# Altium project Main.PrjPcb
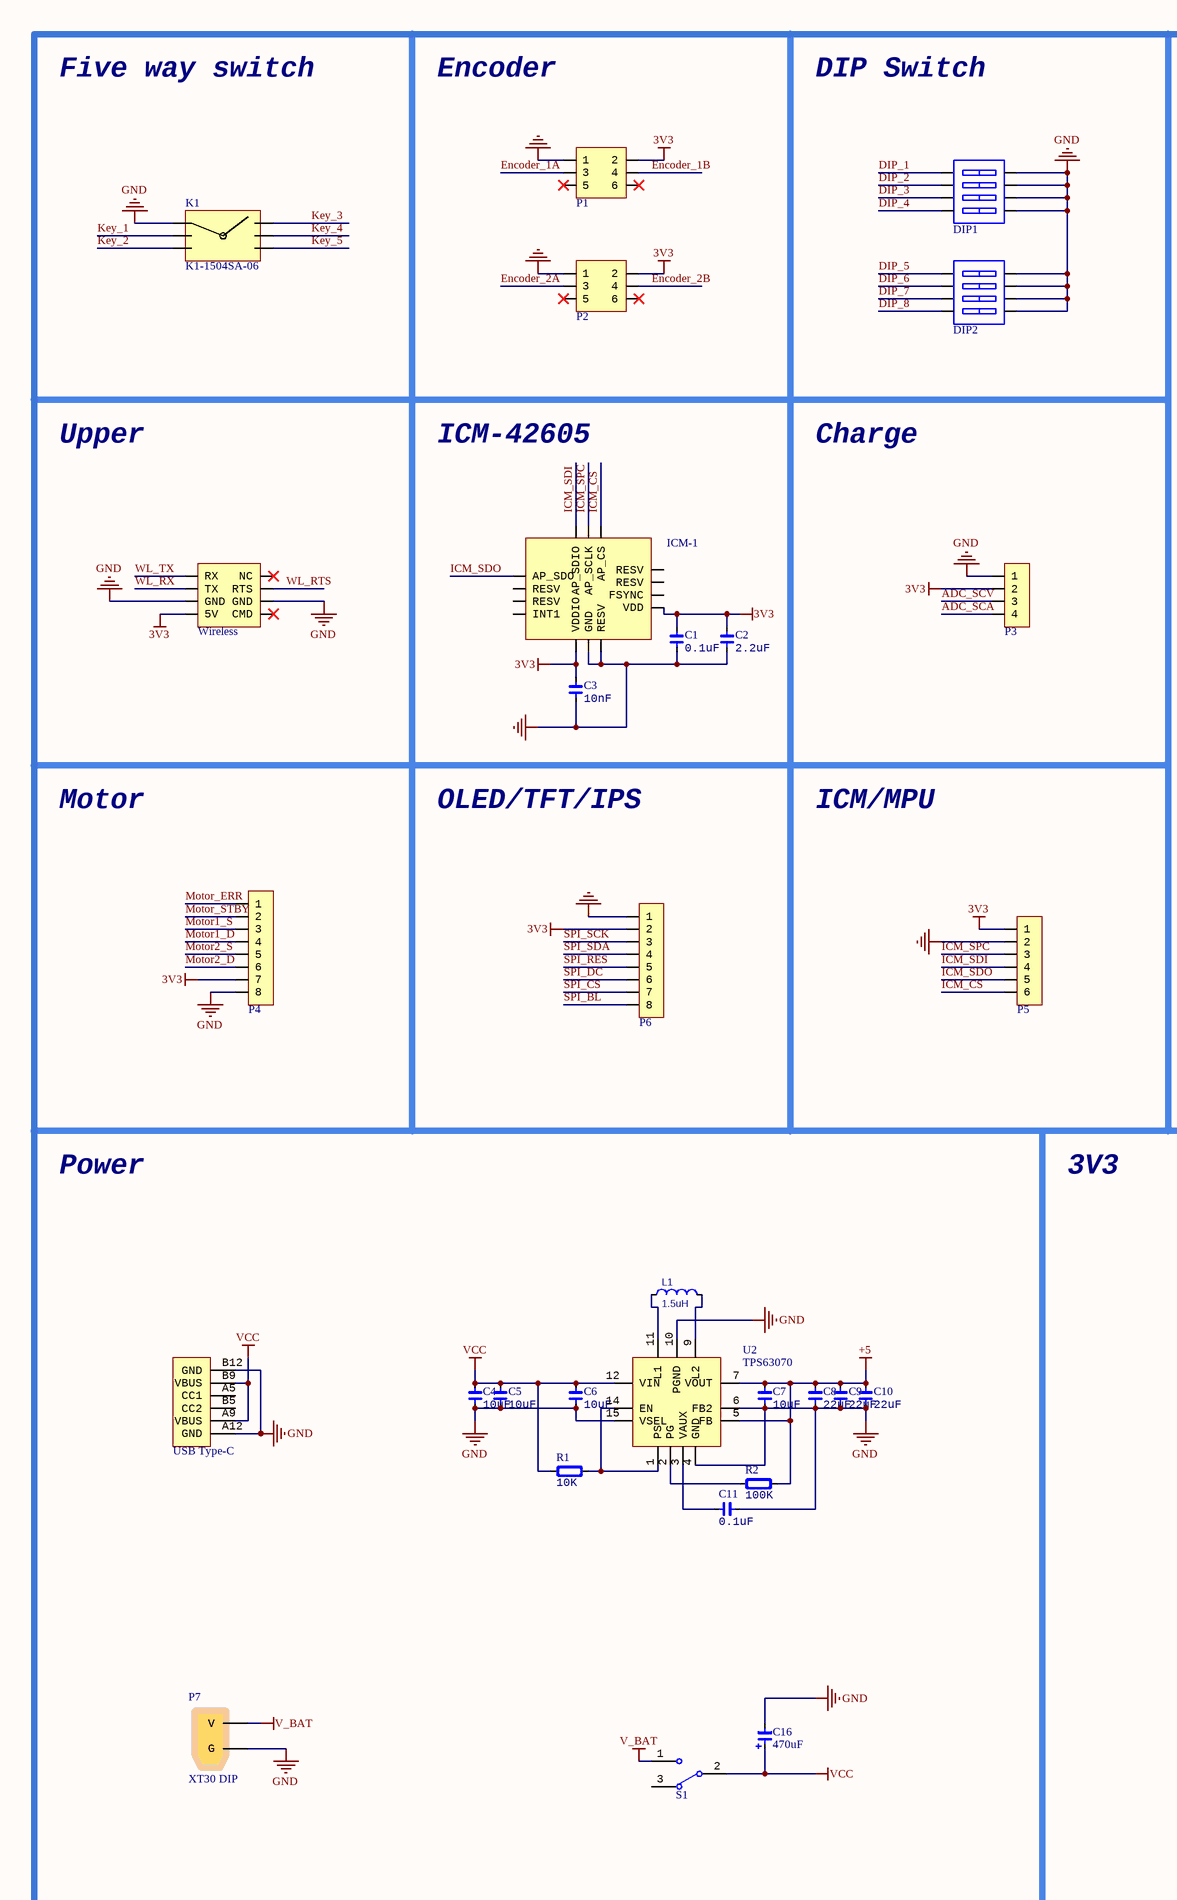
[diagram p0: Main.SchDoc, left]
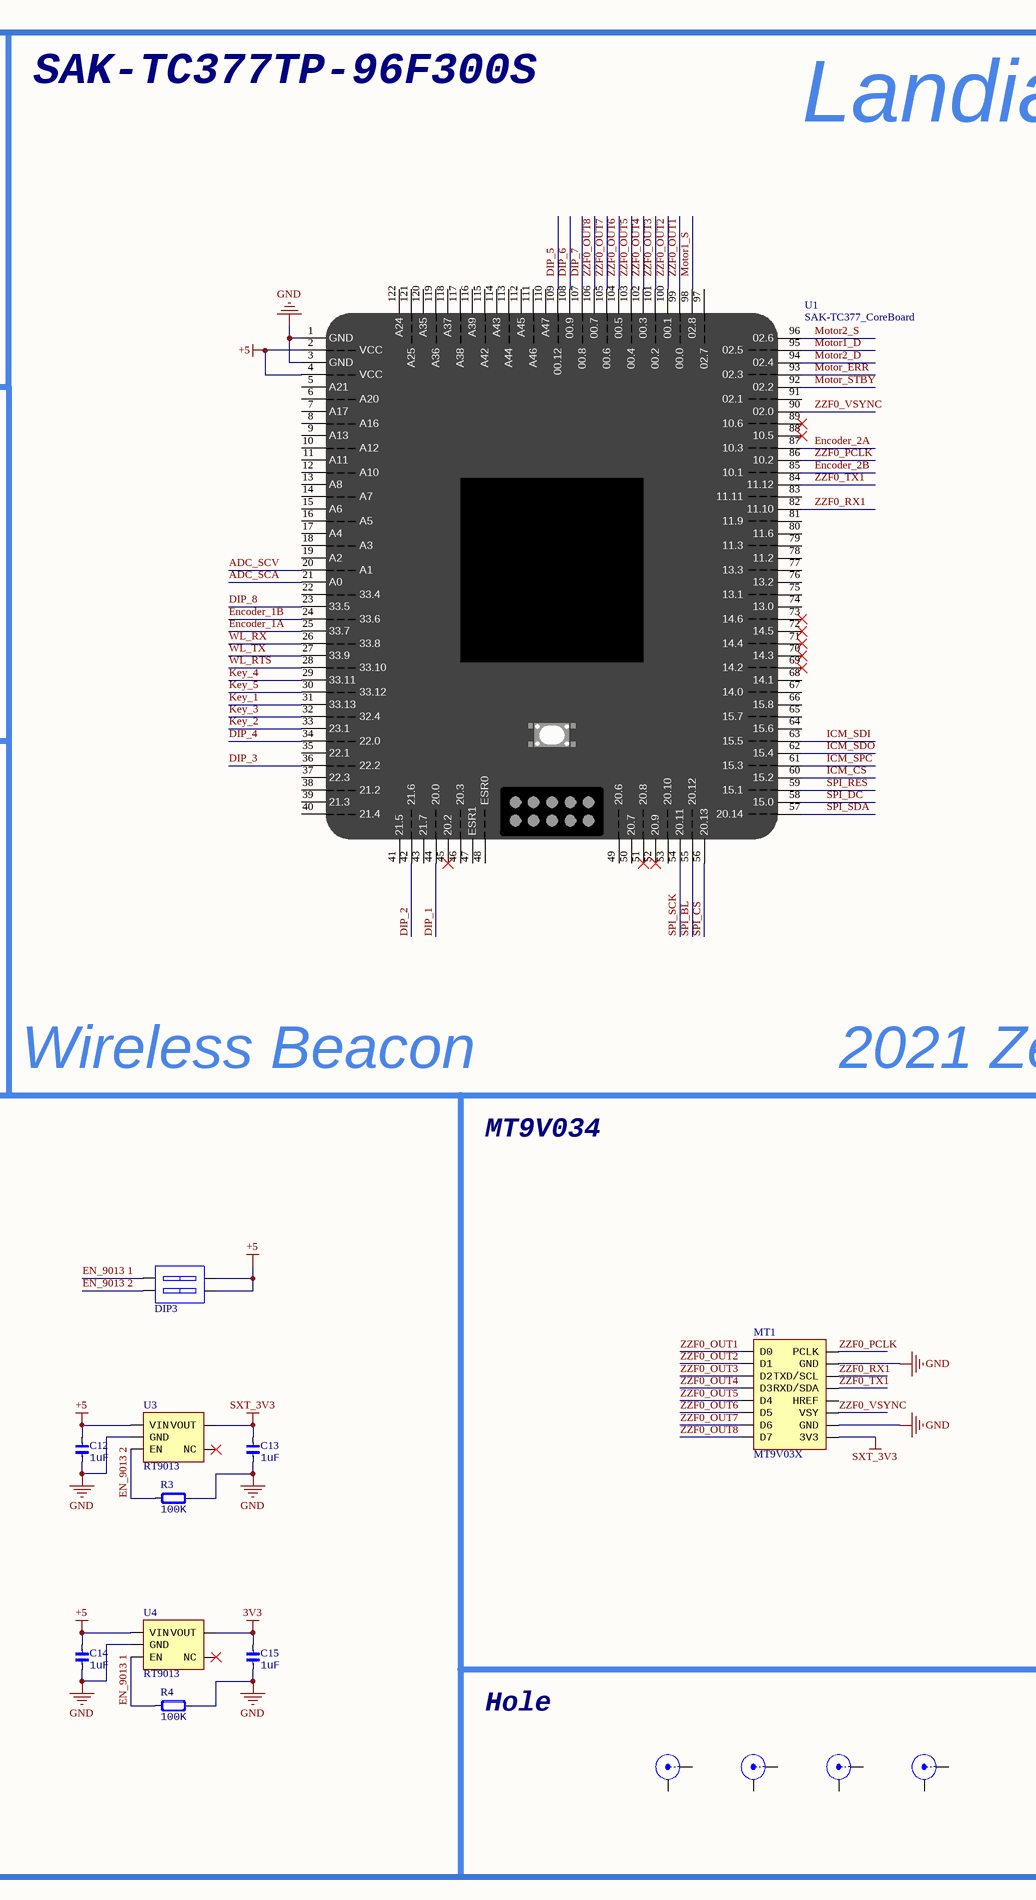
[diagram p1: Main.SchDoc, right]
1 sheet, 45 parts. Net scope: global (net labels, ports and power ports of the same name join across sheets).
Board file: Main.PcbDoc

## Sheet Main.SchDoc
size 477 x 398 mm; SheetNumber: 1; SheetTotal: 1

### Parts
C1  0.1uF  [0805_CAP]
C2  2.2uF  [0805_CAP]
C3  10nF  [0805_CAP]
C4  10uF  [0805_CAP]
C5  10uF  [0805_CAP]
C6  10uF  [0603_CAP]
C7  10uF  [0603_CAP]
C8  22uF  [0805_CAP]
C9  22uF  [0805_CAP]
C10  22uF  [0805_CAP]
C11  0.1uF  [0805_CAP]
C12  1uF  [0805_CAP]
C13  1uF  [0805_CAP]
C14  1uF  [0805_CAP]
C15  1uF  [0805_CAP]
C16  470uF  [CAP_8X10]
DIP1  CSW-4P_SMD  [DIP Switch 4P - SMD]  (value not drawn)
DIP2  CSW-4P_SMD  [DIP Switch 4P - SMD]  (value not drawn)
DIP3  CSW-2P  [DIP Switch 2P]  (value not drawn)
Hole1  Hole  [Hole]  (value not drawn)
Hole2  Hole  [Hole]  (value not drawn)
Hole3  Hole  [Hole]  (value not drawn)
Hole4  Hole  [Hole]  (value not drawn)
ICM-1  ICM-42605  [LGA-14_L3.0-W2.5-P0.50-TL]  (value not drawn)
K1  K1-1504SA-06  [SW-SMD_K1-1504SA-06]
L1  1.5uH  [CDRH74R]
MT1  MT9V03X  [MT9V034]
P1  HDR2x3_2.54  [HDR_2X3]  (value not drawn)
P2  HDR2x3_2.54  [HDR_2X3]  (value not drawn)
P3  HDR1x4_2.54  [HDR_1X4]  (value not drawn)
P4  HDR1x8_2.54_F  [HDR_1X8_F]  (value not drawn)
P5  HDR1x6_2.54  [HDR_1X6]  (value not drawn)
P6  HDR1x8_2.54_F  [HDR_1X8_F]  (value not drawn)
P7  XT30 DIP  [XT30 DIP]
R1  10K  [0805_RES]
R2  100K  [0805_RES]
R3  100K  [0805_RES]
R4  100K  [0805_RES]
S1  SMTS-102  [SMTS-102]  (value not drawn)
Type-C1  USB Type-C  [Type-C 6P]
U1  SAK-TC377_CoreBoard  [TC377_CoreBoard]
U2  TPS63070  [VQFN-15_L3.0-W2.5-P0.50-BL]
U3  RT9013  [SOT-23-5_L3.0-W1.7-P0.95-LS2.8-BR]
U4  RT9013  [SOT-23-5_L3.0-W1.7-P0.95-LS2.8-BR]
Wireless1  Wireless  [HDR_2X4_F]

### Nets
3V3: C1.1 C2.1 C3.1 C15.2 ICM-1.5(VDDIO) ICM-1.8(VDD) P1.2 P2.2 P3.2 P4.7 P5.1 P6.2 U4.5(VOUT) Wireless1.7(5V)
+5: C7.2 C8.2 C9.2 C10.2 C12.2 C14.2 DIP3.4 DIP3.5 R2.2 U1.2(VCC) U1.4(VCC) U2.5(FB) U2.7(VOUT) U3.1(VIN) U4.1(VIN)
GND: C1.2 C2.2 C3.2 C4.1 C5.1 C6.1 C7.1 C8.1 C9.1 C10.1 C11.1 C12.1 C13.1 C14.1 C15.1 C16.2 DIP1.5 DIP1.6 DIP1.7 DIP1.8 DIP2.5 DIP2.6 DIP2.7 DIP2.8 ICM-1.6(GND) ICM-1.7(RESV) K1.1 MT1.4(GND) MT1.14(GND) P1.1 P2.1 P3.1 P4.8 P5.2 P6.1 P7.2(G) R3.2 R4.2 Type-C1.A12(GND) Type-C1.B12(GND) U1.1(GND) U1.3(GND) U2.4(GND) U2.6(FB2) U2.10(PGND) U2.15(VSEL) U3.2(GND) U4.2(GND) Wireless1.5(GND) Wireless1.6(GND)
SXT_3V3: C13.2 MT1.16(3V3) U3.5(VOUT)
V_BAT: P7.1(V) S1.1
VCC: C4.2 C5.2 C6.2 C16.1 R1.1 S1.2 Type-C1.A9(VBUS) Type-C1.B9(VBUS) U2.12(VIN)
ADC_SCA: P3.4 U1.21(A0)
ADC_SCV: P3.3 U1.20(A1)
DIP_1: DIP1.1 U1.44(20.0)
DIP_2: DIP1.2 U1.42(21.6)
DIP_3: DIP1.3 U1.36(22.2)
DIP_4: DIP1.4 U1.34(22.0)
DIP_5: DIP2.1 U1.109(00.12)
DIP_6: DIP2.2 U1.108(00.9)
DIP_7: DIP2.3 U1.107(00.8)
DIP_8: DIP2.4 U1.23(33.5)
EN_9013 1: DIP3.1 R4.1 U4.3(EN)
EN_9013 2: DIP3.2 R3.1 U3.3(EN)
Encoder_1A: P1.3 U1.25(33.7)
Encoder_1B: P1.4 U1.24(33.6)
Encoder_2A: P2.3 U1.87(10.3)
Encoder_2B: P2.4 U1.85(10.1)
ICM_CS: ICM-1.12(AP_CS) P5.6 U1.60(15.2)
ICM_SDI: ICM-1.14(AP_SDIO) P5.4 U1.63(15.5)
ICM_SDO: ICM-1.1(AP_SDO) P5.5 U1.62(15.4)
ICM_SPC: ICM-1.13(AP_SCLK) P5.3 U1.61(15.3)
Key_1: K1.2 U1.31(33.13)
Key_2: K1.3 U1.33(23.1)
Key_3: K1.4 U1.32(32.4)
Key_4: K1.5 U1.29(33.11)
Key_5: K1.6 U1.30(33.12)
Motor1_D: P4.4 U1.95(02.5)
Motor1_S: P4.3 U1.98(02.8)
Motor2_D: P4.6 U1.94(02.4)
Motor2_S: P4.5 U1.96(02.6)
Motor_ERR: P4.1 U1.93(02.3)
Motor_STBY: P4.2 U1.92(02.2)
SPI_BL: P6.8 U1.55(20.12)
SPI_CS: P6.7 U1.56(20.13)
SPI_DC: P6.6 U1.58(15.0)
SPI_RES: P6.5 U1.59(15.1)
SPI_SCK: P6.3 U1.54(20.11)
SPI_SDA: P6.4 U1.57(20.14)
WL_RTS: U1.28(33.10) Wireless1.4(RTS)
WL_RX: U1.26(33.8) Wireless1.3(TX)
WL_TX: U1.27(33.9) Wireless1.1(RX)
ZZF0_OUT1: MT1.1(D0) U1.99(00.0)
ZZF0_OUT2: MT1.3(D1) U1.100(00.1)
ZZF0_OUT3: MT1.5(D2) U1.101(00.2)
ZZF0_OUT4: MT1.7(D3) U1.102(00.3)
ZZF0_OUT5: MT1.9(D4) U1.103(00.4)
ZZF0_OUT6: MT1.11(D5) U1.104(00.5)
ZZF0_OUT7: MT1.13(D6) U1.105(00.6)
ZZF0_OUT8: MT1.15(D7) U1.106(00.7)
ZZF0_PCLK: MT1.2(PCLK) U1.86(10.2)
ZZF0_RX1: MT1.6(TXD/SCL) U1.82(11.10)
ZZF0_TX1: MT1.8(RXD/SDA) U1.84(11.12)
ZZF0_VSYNC: MT1.12(VSY) U1.90(02.0)
NetC11_2: C11.2 U2.3(VAUX)
NetL1_1: L1.1 U2.11(L1)
NetL1_2: L1.2 U2.9(L2)
NetR1_2: R1.2 U2.1(PS) U2.14(EN)
NetR2_1: R2.1 U2.2(PG)

Not connected (* = marked no-connect by the designer): Hole1 1(X) 2(Y); Hole2 1(X) 2(Y); Hole3 1(X) 2(Y); Hole4 1(X) 2(Y); ICM-1 2(RESV) 3(RESV) 4(INT1) 9(FSYNC) 10(RESV) 11(RESV); MT1 10(HREF); P1 5* 6*; P2 5* 6*; S1 3; Type-C1 A5(CC1) B5(CC2); U1 5(A21) 6(A20) 7(A17) 8(A16) 9(A13) 10(A12) 11(A11) 12(A10) 13(A8) 14(A7) 15(A6) 16(A5) 17(A4) 18(A3) 19(A2) 22(33.4) 35(22.1) 37(22.3) 38(21.2) 39(21.3) 40(21.4) 41(21.5) 43(21.7) 45(20.2)* 46(20.3) 47(ESR1) 48(ESR0) 49(20.6) 50(20.7) 51(20.8)* 52(20.9)* 53(20.10) 64(15.6) 65(15.7) 66(15.8) 67(14.0) 68(14.1) 69(14.2)* 70(14.3)* 71(14.4)* 72(14.5)* 73(14.6)* 74(13.0) 75(13.1) 76(13.2) 77(13.3) 78(11.2) 79(11.3) 80(11.6) 81(11.9) 83(11.11) 88(10.5)* 89(10.6)* 91(02.1) 97(02.7) 110(A47) 111(A46) 112(A45) 113(A44) 114(A43) 115(A42) 116(A39) 117(A38) 118(A37) 119(A36) 120(A35) 121(A25) 122(A24); U3 4(NC)*; U4 4(NC)*; Wireless1 2(NC)* 8(CMD)*

### Notes on the sheet
- Five way switch
- Encoder
- DIP Switch
- SAK-TC377TP-96F300S
- Landian
- Upper
- ICM-42605
- Charge
- Motor
- OLED/TFT/IPS
- ICM/MPU
- Wireless Beacon
- 2021 Zero
- Power
- 3V3
- MT9V034
- Hole

### Library data of the parts
C1-C5 C8-C15 = 0805_CAP: Capacitor; Specification: X7R 50V; Manufacturer: *
C6 C7 = 0603_CAP: Capacitor; Specification: X7R 50V; Manufacturer: *
C16 = CAP_10: Electrolytic capacitor
DIP1 DIP2 = CSW-4P_SMD: BOM名称: 3路编码开关; 版权归属: 源创客; 学习资源: www.ooocke.com
DIP3 = CSW-2P: 2路编码开关; BOM名称: 3路编码开关; 版权归属: 源创客; 学习资源: www.ooocke.com
K1 = K1-1504SA-06: K1-1504SA-06 五向开关
L1 = IND: Inductor; BOM_Manufacturer: microgate; BOM_Manufacturer Part: MPIT6045-330M-LF; nameAlias: Inductance; Contributor: LCSC; BOM_Supplier: LCSC; BOM_Supplier Part: C696490; spicePre: L; spiceSymbolName: MPIT6045-330M-LF
MT1 = MT9V03X: MT9V03X转接板
P1 P2 = HDR2x3_2.54: Header
P3 = HDR1x4_2.54: Header
P4 P6 = HDR1x8_2.54_F: Header
P5 = HDR1x6_2.54: Header
P7 = XT30 DIP: XT30 板载直头直插
R1-R4 = 0805_RES: Resistor; Specification: ±5%; Manufacturer: *
Type-C1 = USB_Type-C_6P: Type-C 6P
U1 = SAK-TC377_CoreBoard: 逐飞科技TC377核心板